# Altium schematic sheet CW308T_AVR_CONN.SchDoc: CW308 Connections
size Letter; Organization: NewAE Technology Inc.; Address1: 1083 Queen St., Suite 196; Address2: Halifax; Address3: NS; Address4: Canada B3H 0B2; SheetNumber: 2; SheetTotal: 2; SheetApproved: YES
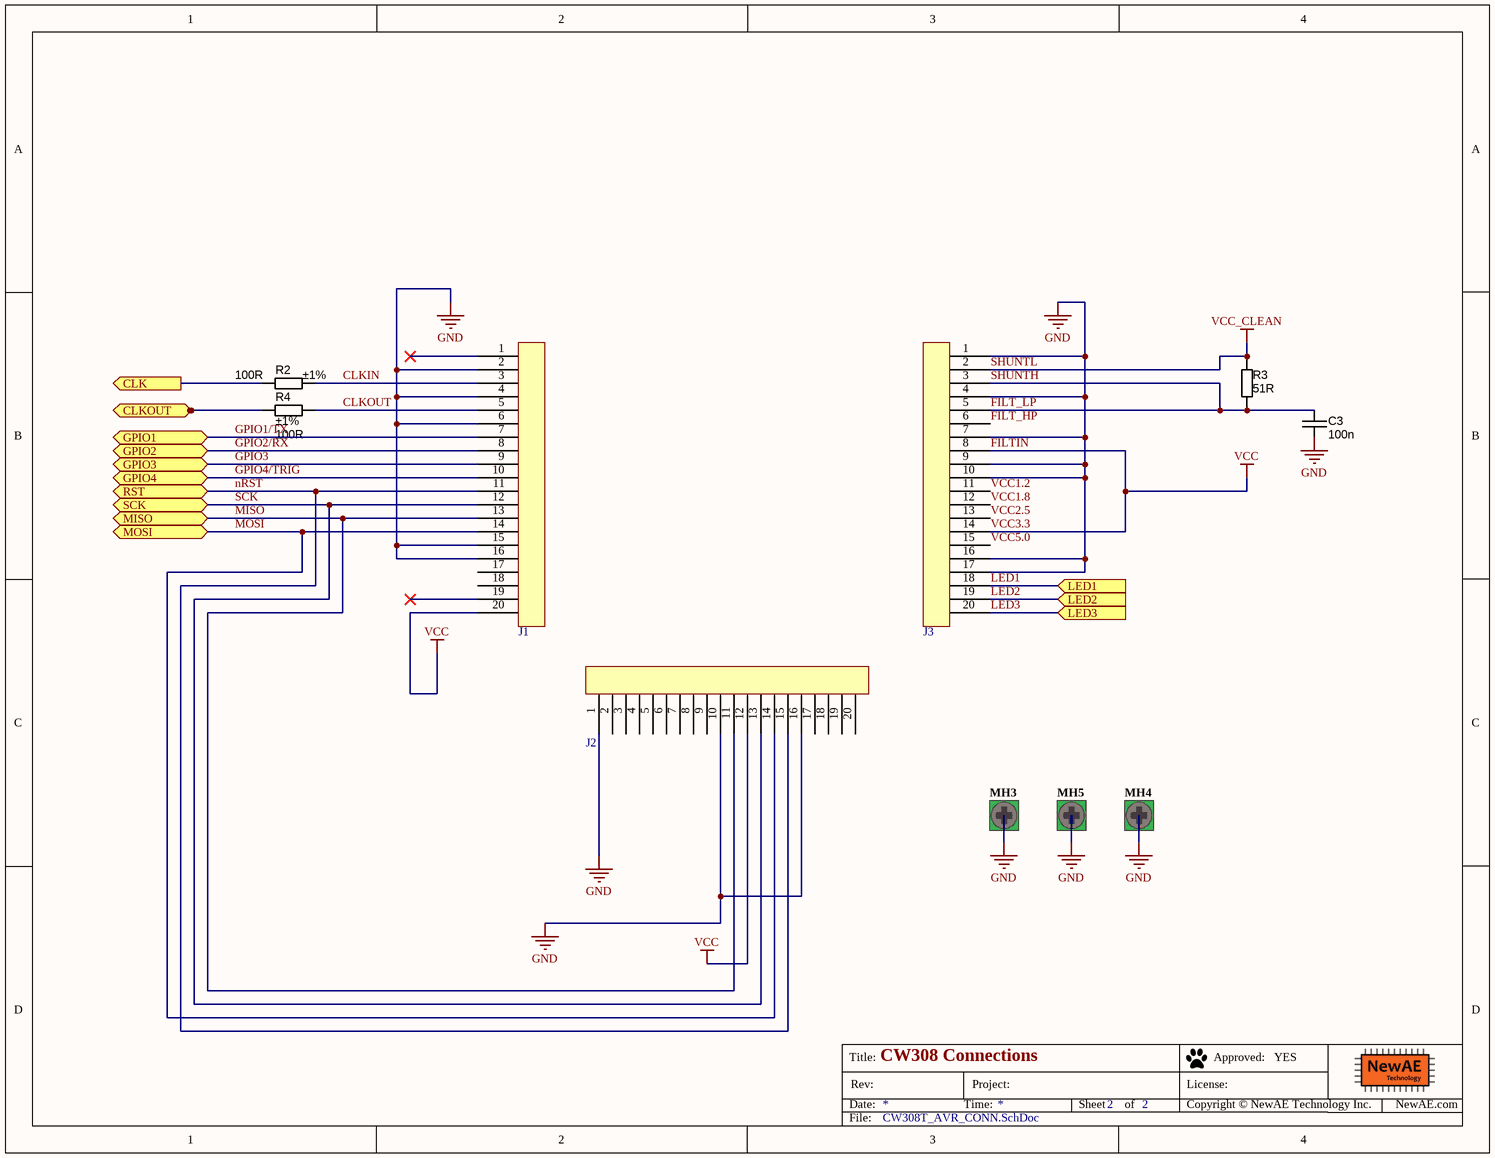
[diagram p0: CW308T_AVR_CONN.SchDoc]

## Parts
C3  value 100n  [CAPC1608X90N]  (hidden comment: approved sub OK)
J1  20-Pin Header  [801-87-020-10-001101]  (value not drawn)
J2  20-Pin Header  [801-87-020-10-001101]  (value not drawn)
J3  20-Pin Header  [801-87-020-10-001101]  (value not drawn)
MH3  Mounting-Hole-RND-Altium  [Mounting-Hole-RND-Altium]  (value not drawn)  (no BOM)
MH4  Mounting-Hole-RND-Altium  [Mounting-Hole-RND-Altium]  (value not drawn)  (no BOM)
MH5  Mounting-Hole-RND-Altium  [Mounting-Hole-RND-Altium]  (value not drawn)  (no BOM)
R2  value 100R  Tolerance: ±1%  [RESC1608X55N]  (hidden comment: Thick Film)
R3  value 51R  [RESC2012X70N]  (hidden comment: Thick Film)
R4  value 100R  Tolerance: ±1%  [RESC1608X55N]  (hidden comment: Thick Film)

## Ports
CLK (out), CLKOUT (in), GPIO1 (bidir), GPIO2 (bidir), GPIO3 (bidir), GPIO4 (bidir), LED1 (in), LED2 (in), LED3 (in), MISO (bidir), MOSI (bidir), RST (bidir), SCK (bidir)

## Nets
FILTIN: J1.20 J2.12 J3.8 J3.14  [also labelled VCC, VCC3.3]
GND: C3.2 J1.2 J1.4 J1.6 J1.15 J1.16 J2.1 J2.10 J2.16 J3.1 J3.4 J3.7 J3.9 J3.10 J3.16 J3.17 MH3.1 MH4.1 MH5.1
SHUNTL: J3.2 R3.1  [also labelled VCC_CLEAN]
CLK: R2.1 ; port CLK
CLKIN: J1.3 R2.2
CLKOUT: J1.5 R4.2
CLKOUT: R4.1 ; port CLKOUT  [a separate net that carries the same name]
FILT_HP: J3.6
FILT_LP: C3.1 J3.3 J3.5 R3.2  [also labelled SHUNTH]
GPIO1/TX: J1.7 ; port GPIO1
GPIO2/RX: J1.8 ; port GPIO2
GPIO3: J1.9 ; port GPIO3
GPIO4/TRIG: J1.10 ; port GPIO4
LED1: J3.18 ; port LED1
LED2: J3.19 ; port LED2
LED3: J3.20 ; port LED3
MISO: J1.13 J2.11 ; port MISO
MOSI: J1.14 J2.14 ; port MOSI
nRST: J1.11 J2.15 ; port RST
SCK: J1.12 J2.13 ; port SCK
VCC1.2: J3.11
VCC1.8: J3.12
VCC2.5: J3.13
VCC5.0: J3.15

Not connected (* = marked no-connect by the designer): J1 1* 17 18 19*; J2 2 3 4 5 6 7 8 9 17 18 19 20

## Notes on the sheet
- Title:
- Date:
- Rev:
- Time:
- Project:
- Sheet
- of
- License:
- Copyright © NewAE Technology Inc.
- Approved:
- NewAE.com
- File:

## Library data of the parts
C3 = CAPC_100n_0603_X7R_50V_10%: Capacitor SMD Cer 100nF 10% 50V X7R 0603; Manufacturer 1: AVX Corporation; Manufacturer Part Number 1: 06035C104KAT2A; Ratings: 50V; X7R; Material: ceramic; SCDType: spec; Manufacturer 2: TDK Corporation; Manufacturer Part Number 2: C1608X7R1H104K; Package / Case: 0603 (1608 Metric); Tolerance: ±10%; Supplier 1: Digi-Key; Supplier Part Number 1: 478-5052-1-ND; ComponentLink1URL: http://www.avx.com/docs/Catalogs/cx7r.pdf; ComponentLink1Description: http://www.avx.com/docs/Catalogs/cx7r.pdf; Supplier 2: Digi-Key; Supplier Part Number 2: 445-1314-1-ND; ComponentLink2URL: http://product.tdk.com/capacitor/mlcc/en/documents/mlcc_commercial_general_en.pdf; ComponentLink2Description: http://product.tdk.com/capacitor/mlcc/en/documents/mlcc_commercial_general_en.pdf
J1-J3 = 801-87-020-10-001101: 1x20 Header, Machined; Manufacture 1: Preci-Dip SA; Manufacture Part Number 1: 801-87-020-10-001101; Supplier 1: Digi-Key; Supplier Part Number 1: 1212-1207-ND
MH3-MH5 = CMP-0001-00029-1: Mounting Hole, Altium, 4.4mm pad, 3.4mm plated hole; Publisher: Altium; ClassName: Mounting Hole
R2 R4 = RES_100R_0603_1%: Resistor SMD chip 100 Ohm 0.1W 1% 0603; Manufacturer 1: Yageo; Manufacturer Part Number 1: RC0603FR-07100RL; Ratings: 1/10 W; SCDType: spec; Package / Case: 0603 (1608 Metric); Material: Thick Film; Supplier 1: Digi-Key; Supplier Part Number 1: 311-100HRCT-ND; Supplier 2: Digi-Key; Supplier Part Number 2: P100HTR-ND; Manufacturer 2: Panasonic - ECG; Manufacturer Part Number 2: ERJ-3EKF1000V; ComponentLink1URL: http://industrial.panasonic.com/www-cgi/jvcr13pz.cgi?E+PZ+3+AOA0002+ERJ3EKF1000V+7+WW; ComponentLink1Description: http://industrial.panasonic.com/www-cgi/jvcr13pz.cgi?E+PZ+3+AOA0002+ERJ3EKF1000V+7+WW
R3 = RES_15R_0805_5%: Resistor SMD chip 15 Ohm 0.125W 5% 0805; Manufacturer 1: Yageo; Manufacturer Part Number 1: RC0805JR-0715RL; Ratings: 1/8W; SCDType: spec; Tolerance: ±5%; Package / Case: 0805 (2012 metric); Supplier 1: Digi-Key; Supplier Part Number 1: 311-15ARCT-ND; RoHS 1: RoHS Compliant; ComponentLink1URL: http://media.digikey.com/pdf/Data%20Sheets/Yageo%20PDFs/RC0805%20Pb%20Free.pdf; ComponentLink1Description: http://media.digikey.com/pdf/Data%20Sheets/Yageo%20PDFs/RC0805%20Pb%20Free.pdf; Supplier 2: Digi-Key; Supplier Part Number 2: P15ACT-ND; Manufacturer 2: Panasonic Electronic Components; Manufacturer Part Number 2: ERJ-6GEYJ150V; RoHS 2: RoHS Compliant; ComponentLink2URL: http://industrial.panasonic.com/www-cgi/jvcr13pz.cgi?E+PZ+3+AOA0001+ERJ6GEYJ150V+7+WW; ComponentLink2Description: http://industrial.panasonic.com/www-cgi/jvcr13pz.cgi?E+PZ+3+AOA0001+ERJ6GEYJ150V+7+WW; Supplier 3: Digi-Key; Supplier Part Number 3: RMCF0805JT15R0CT-ND; Manufacturer 3: Stackpole Electronics Inc; Manufacturer Part Number 3: RMCF0805JT15R0; RoHS 3: RoHS Compliant; ComponentLink3URL: http://www.seielect.com/Catalog/SEI-RMCF_RMCP.pdf; ComponentLink3Description: http://www.seielect.com/Catalog/SEI-RMCF_RMCP.pdf; Supplier 4: Digi-Key; Supplier Part Number 4: 541-15ACT-ND; Manufacturer 4: Vishay Dale; Manufacturer Part Number 4: CRCW080515R0JNEA; RoHS 4: RoHS Compliant; ComponentLink4URL: http://www.vishay.com/doc?20035; ComponentLink4Description: http://www.vishay.com/doc?20035